# Altium project iRat_2.0.PrjPcb
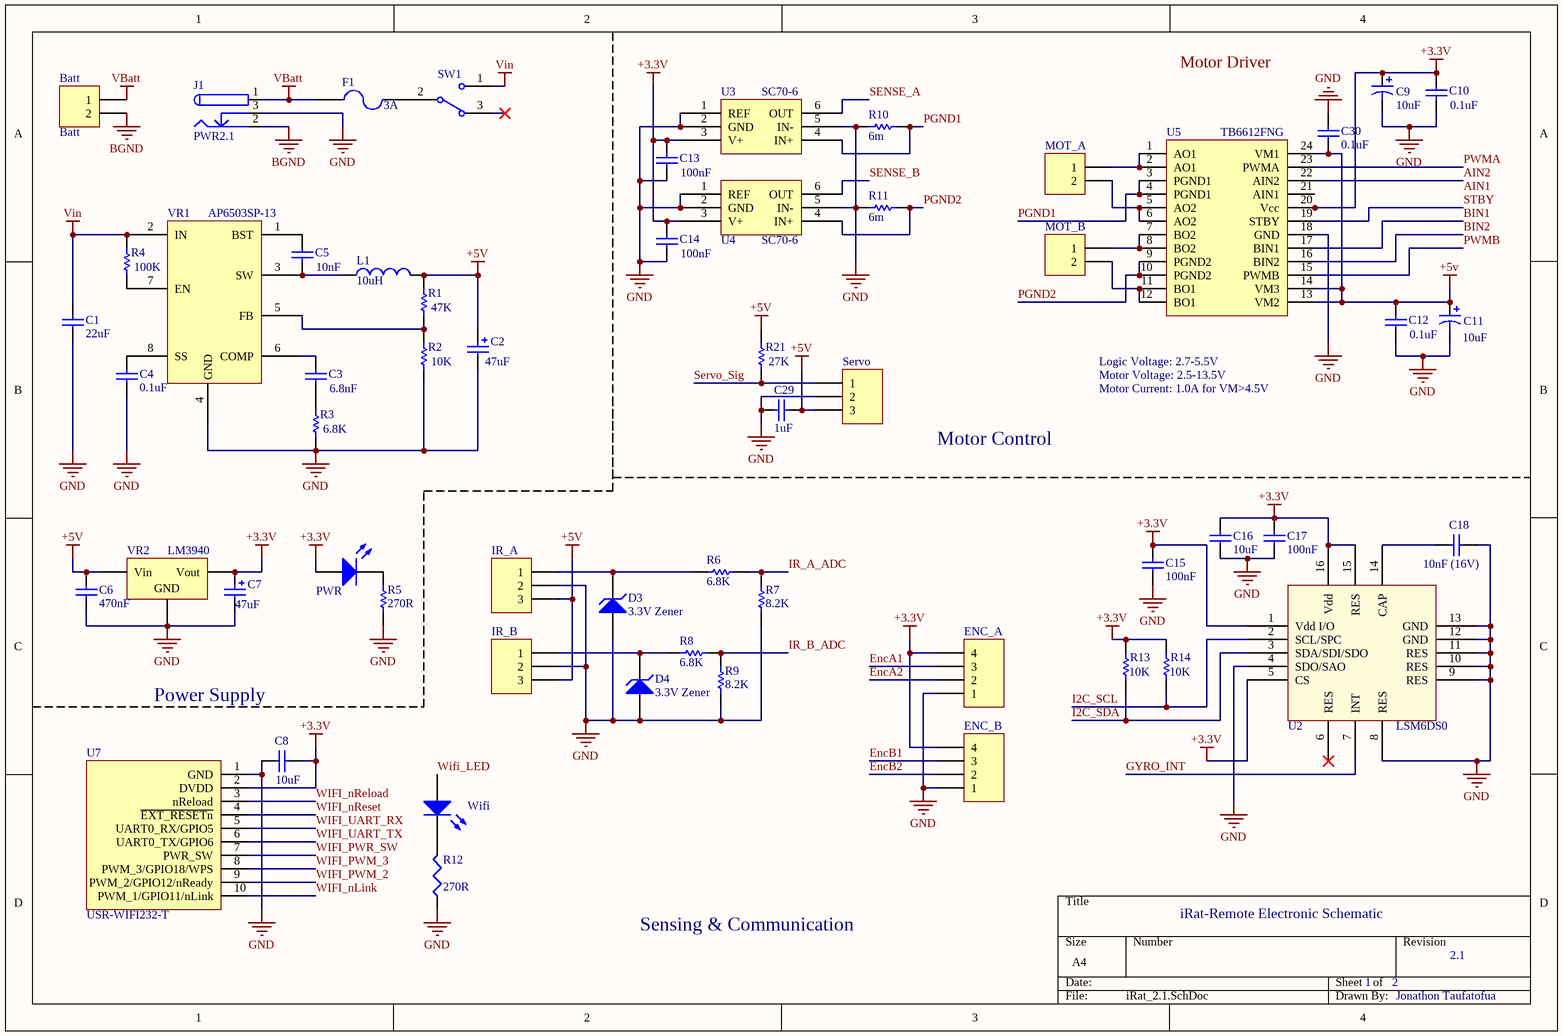
[diagram p0: iRat_2.1.SchDoc]
2 sheets, 82 parts. Net scope: global (net labels, ports and power ports of the same name join across sheets).
Board file: iRat_2.1.PcbDoc
Sheets:
  iRat_2.1.SchDoc
  iRat_2.1_Microcontroller.SchDoc

## Sheet iRat_2.1.SchDoc
size A4

### Parts
Batt  Batt  [Molex 43045-0202]
C1  value 22uF  [0805E]  (hidden comment: Cap Semi)
C2  value 47uF  [Capacitor_SizeD8]  (hidden comment: Cap Pol2)
C3  value 6.8nF  [1608[0603]]  (hidden comment: Cap Semi)
C4  value 0.1uF  [1608[0603]]  (hidden comment: Cap Semi)
C5  value 10nF  [1608[0603]]  (hidden comment: Cap Semi)
C6  value 470nF  [1608[0603]]  (hidden comment: Cap Semi)
C7  value 47uF  [Capacitor_SizeD8]  (hidden comment: Cap Pol2)
C8  value 10uF  [6-0805_N]  (hidden comment: Cap Semi)
C9  value 10uF  [C0805]  (hidden comment: Cap Pol3)
C10  value 0.1uF  [1608[0603]]  (hidden comment: Cap Semi)
C11  value 10uF  [C0805]  (hidden comment: Cap Pol3)
C12  value 0.1uF  [1608[0603]]  (hidden comment: Cap Semi)
C13  value 100nF  [1608[0603]]  (hidden comment: Cap Semi)
C14  value 100nF  [1608[0603]]  (hidden comment: Cap Semi)
C15  value 100nF  [1608[0603]]  (hidden comment: Cap Semi)
C16  value 10uF  [0805E]  (hidden comment: Cap Semi)
C17  value 100nF  [1608[0603]]  (hidden comment: Cap Semi)
C18  value 10nF (16V)  [1608[0603]]  (hidden comment: Req 10nF 10%, 16V Ceramic)
C29  value 1uF  [1608[0603]]  (hidden comment: Cap Semi)
C30  value 0.1uF  [1608[0603]]  (hidden comment: Cap Semi)
D3  3.3V Zener  [MM5Z3V3T1G]
D4  3.3V Zener  [MM5Z3V3T1G]
ENC_A  Header 4  [JST PH 4-Way]  (value not drawn)
ENC_B  Header 4  [JST PH 4-Way]  (value not drawn)
F1  3A  [1812]
IR_A  Header 3  [JST PH 3-Way]  (value not drawn)
IR_B  Header 3  [JST PH 3-Way]  (value not drawn)
J1  PWR2.1  [DCP21]
L1  value 10uH  [SRP7028A-100M]  (hidden comment: Inductor)
MOT_A  Header 2  [HDR1X2]  (value not drawn)
MOT_B  Header 2  [HDR1X2]  (value not drawn)
PWR  LNJ347W83RA  [0402-A]  (value not drawn)
R1  value 47K  [J1-0603]  (hidden comment: Res Semi)
R2  value 10K  [J1-0603]  (hidden comment: Res Semi)
R3  value 6.8K  [J1-0603]  (hidden comment: Res Semi)
R4  value 100K  [J1-0603]  (hidden comment: Res Semi)
R5  value 270R  [0402]  (hidden comment: Res1)
R6  value 6.8K  [0603E]  (hidden comment: Res1)
R7  value 8.2K  [0603E]  (hidden comment: Res1)
R8  value 6.8K  [0603E]  (hidden comment: Res1)
R9  value 8.2K  [0603E]  (hidden comment: Res1)
R10  value 6m  [ERJM1WS]  (hidden comment: Shunt Resistor)
R11  value 6m  [ERJM1WS]  (hidden comment: Shunt Resistor)
R12  value 270R  [0402]  (hidden comment: Res3)
R13  value 10K  [0402]  (hidden comment: Res Semi)
R14  value 10K  [0402]  (hidden comment: Res Semi)
R21  value 27K  [0402]  (hidden comment: Res Semi)
Servo  Servo1  [JST PH 3-Way]  (value not drawn)
SW1  SW-SPDT  [Slide_Switch]  (value not drawn)
U2  LSM6DS0  [LGA16-3X3X1_N]
U3  SC70-6  [SC70]
U4  SC70-6  [SC70]
U5  TB6612FNG  [TSOP65P760X160-24N]
U7  USR-WIFI232-T  [USR-WIFI232-T]
VR1  AP6503SP-13  [SO-8EP]
VR2  LM3940  [SOT223_N]
Wifi  LNJ347W83RA  [0402-A]  (value not drawn)

### Nets
+3.3V: C7.1 C8.1 C9.1 C10.1 C13.2 C14.2 C15.2 C16.2 C17.2 ENC_A.4 ENC_B.4 PWR.1(A) R13.2 R14.2 U2.1(Vdd_I/O) U2.5(CS) U2.15(RES) U2.16(Vdd) U3.3(V+) U4.3(V+) U5.20(Vcc) U7.2(DVDD) VR2.3(Vout)
+5v: C2.1 C6.2 C11.1 C12.1 C29.2 C30.1 IR_A.3 IR_B.3 L1.2 R1.2 R21.2 Servo.3 U5.13(VM2) U5.14(VM3) U5.24(VM1) VR2.1(Vin)
BGND: Batt.2 J1.2
GND: C1.1 C2.2 C4.1 C6.1 C7.2 C8.2 C9.2 C10.2 C11.2 C12.2 C13.1 C14.1 C15.1 C16.1 C17.1 C18.1 C29.1 C30.2 D3.1(A) D4.1(A) ENC_A.1 ENC_B.1 IR_A.2 IR_B.2 J1.3 R2.1 R3.1 R5.1 R7.1 R9.1 R10.2 R11.1 R12.1 Servo.2 U2.4(SDO/SAO) U2.8(RES) U2.9(RES) U2.10(RES) U2.11(RES) U2.12(GND) U2.13(GND) U3.1(REF) U3.2(GND) U3.5(IN-) U4.1(REF) U4.2(GND) U4.5(IN-) U5.18(GND) U7.1(GND) VR1.4(GND) VR2.2(GND)
VBatt: Batt.1 F1.1 J1.1
Vin: C1.2 R4.2 SW1.1 VR1.2(IN)
AIN2: U5.22(AIN2)
BIN1: U5.17(BIN1)
BIN2: U5.16(BIN2)
EncA1: ENC_A.3
EncA2: ENC_A.2
EncB1: ENC_B.3
EncB2: ENC_B.2
GYRO_INT: U2.7(INT)
I2C_SCL: R14.1 U2.2(SCL/SPC)
I2C_SDA: R13.1 U2.3(SDA/SDI/SDO)
IR_A_ADC: R6.1 R7.2
IR_B_ADC: R8.1 R9.2
PGND1: R10.1 U3.4(IN+) U5.3(PGND1) U5.4(PGND1)
PGND2: R11.2 U4.4(IN+) U5.9(PGND2) U5.10(PGND2)
PWMA: U5.23(PWMA)
PWMB: U5.15(PWMB)
SENSE_A: U3.6(OUT)
SENSE_B: U4.6(OUT)
Servo_Sig: R21.1 Servo.1
STBY: U5.19(STBY)
Wifi_LED: Wifi.1(A)
WIFI_nLink: U7.10(PWM_1/GPIO11/nLink)
WIFI_nReload: U7.3(nReload)
WIFI_nReset: U7.4(~{EXT_RESETn})
WIFI_PWM_2: U7.9(PWM_2/GPIO12/nReady)
WIFI_PWM_3: U7.8(PWM_3/GPIO18/WPS)
WIFI_PWR_SW: U7.7(PWR_SW)
WIFI_UART_RX: U7.5(UART0_RX/GPIO5)
WIFI_UART_TX: U7.6(UART0_TX/GPIO6)
NetC3_1: C3.1 R3.2
NetC3_2: C3.2 VR1.6(COMP)
NetC4_2: C4.2 VR1.8(SS)
NetC5_1: C5.1 L1.1 VR1.3(SW)
NetC5_2: C5.2 VR1.1(BST)
NetC18_2: C18.2 U2.14(CAP)
NetD3_2: D3.2(K) IR_A.1 R6.2
NetD4_2: D4.2(K) IR_B.1 R8.2
NetF1_2: F1.2 SW1.2
NetMOT_A_1: MOT_A.1 U5.1(AO1) U5.2(AO1)
NetMOT_A_2: MOT_A.2 U5.5(AO2) U5.6(AO2)
NetMOT_B_1: MOT_B.1 U5.7(BO2) U5.8(BO2)
NetMOT_B_2: MOT_B.2 U5.11(BO1) U5.12(BO1)
NetPWR_2: PWR.2(K) R5.2
NetR1_1: R1.1 R2.2 VR1.5(FB)
NetR4_1: R4.1 VR1.7(EN)
NetR12_2: R12.2 Wifi.2(K)

Not connected (* = marked no-connect by the designer): SW1 3*; U2 6(RES)*; U5 21(AIN1); VR2 4(GND)

### Notes on the sheet
- Motor Driver
- Logic Voltage: 2.7-5.5V
- Motor Voltage: 2.5-13.5V
- Motor Control
- Motor Current: 1.0A for VM>4.5V
- Power Supply
- iRat-Remote Electronic Schematic
- Sensing & Communication
- 1
- 2
- 2.1
- Jonathon Taufatofua
- Labels drawn without touching a wire or pin: AIN1

### Library data of the parts
Batt MOT_A MOT_B = Header 2: Header, 2-Pin; LatestRevisionDate: 17-Jul-2002; LatestRevisionNote: Re-released for DXP Platform.; Publisher: Altium Limited
C1 C3-C6 C8 C10 C12-C18 C29 C30 = Cap Semi: Capacitor (Semiconductor SIM Model); Published: 8-Jun-2000; LatestRevisionDate: 29-May-2009; LatestRevisionNote: IPC-7351 Footprint Added.; PackageReference: C1206; Publisher: Altium Limited; PackageDescription: Chip Capacitor
C2 = Cap Pol2: Polarized Capacitor (Radial); Published: 8-Jun-2000; LatestRevisionDate: 17-Jul-2002; LatestRevisionNote: Re-released for DXP Platform.; PackageReference: POLAR0.8; Publisher: Altium Limited; PackageDescription: Polarized Capacitor; 2 Leads
C7 = Cap Pol2: Polarized Capacitor (Radial); Note: Needs at least 33uF for stability
C9 C11 = Cap Pol3: Polarized Capacitor (Surface Mount); Published: 8-Jun-2000; LatestRevisionDate: 29-May-2009; LatestRevisionNote: IPC-7351 Footprint Added.; PackageReference: C0805; Publisher: Altium Limited; PackageDescription: Chip Capacitor
D3 D4 = D Zener: Zener Diode; Published: 8-Jun-2000; LatestRevisionDate: 17-Jul-2002; LatestRevisionNote: Re-released for DXP Platform.; PackageReference: DIODE-0.7; Publisher: Altium Limited; PackageDescription: Diode, Thru-Hole; 2 Leads; 0.7 in Pin Spacing
ENC_A ENC_B = Header 4: Header, 4-Pin; LatestRevisionDate: 17-Jul-2002; LatestRevisionNote: Re-released for DXP Platform.; Publisher: Altium Limited
F1 = Fuse 2: Fuse; Published: 8-Jun-2000; LatestRevisionDate: 17-Jul-2002; LatestRevisionNote: Re-released for DXP Platform.; PackageReference: PIN-W2/E2.8; Publisher: Altium Limited; PackageDescription: Thru-Hole; 2 Leads
IR_A IR_B Servo = Header 3: Header, 3-Pin; LatestRevisionDate: 17-Jul-2002; LatestRevisionNote: Re-released for DXP Platform.; Publisher: Altium Limited
J1 = PWR2.5: Low Voltage Power Supply Connector; Published: 17-Dec-2003; DatasheetDocument: 09-May-2002; Publisher: Altium Limited; ComponentLink1Description: Manufacturer Link; ComponentLink1URL: http://domino.kycon.com/internet/Products.html
L1 = Inductor: Code_IEC: 1005; Published: 8-Jun-2000; LatestRevisionDate: 29-May-2009; LatestRevisionNote: IPC-7351 Footprint Added.; PackageReference: 0402-A; Publisher: Altium Limited; PackageDescription: Chip Inductor; Code_JEITA: 0402
PWR = LED2: GREEN Power LED; Published: 8-Jun-2000; LatestRevisionDate: 17-Jul-2002; LatestRevisionNote: Re-released for DXP Platform.; PackageVersion: Feb-2002; PackageReference: 3.2X1.6X1.1; Publisher: Altium Limited; PackageDescription: SM LED; 2 Flat Leads
R1-R4 R13 R14 R21 = Res Semi: Semiconductor Resistor; Published: 8-Jun-2000; LatestRevisionDate: 17-Jul-2002; LatestRevisionNote: Re-released for DXP Platform.; PackageReference: AXIAL-0.5; Publisher: Altium Limited; PackageDescription: Axial Device, Thru-Hole; 2 Leads; 0.5 in Pin Spacing
R5-R9 = Res1: Resistor; Published: 8-Jun-2000; LatestRevisionDate: 17-Jul-2002; LatestRevisionNote: Re-released for DXP Platform.; PackageReference: AXIAL-0.3; Publisher: Altium Limited; PackageDescription: Axial Device, Thru-Hole; 2 Leads; 0.3 in Pin Spacing
R10 R11 = Res1: Current Sense Resistor; Published: 8-Jun-2000; LatestRevisionDate: 17-Jul-2002; LatestRevisionNote: Re-released for DXP Platform.; PackageReference: AXIAL-0.3; Publisher: Altium Limited; PackageDescription: Axial Device, Thru-Hole; 2 Leads; 0.3 in Pin Spacing
R12 = Res3: Resistor; Published: 8-Jun-2000; LatestRevisionDate: 29-May-2009; LatestRevisionNote: IPC-7351 Footprint Added.; PackageReference: J1-0603; Publisher: Altium Limited; PackageDescription: Chip Resistor
SW1 = SW-SPDT: SPDT Subminiature Toggle Switch, Right Angle Mounting, Vertical Actuation; Published: 24-Mar-1999; LatestRevisionDate: 17-Dec-2003; LatestRevisionNote: Schematic revised, PCB Footprint replaced.; DatasheetVersion: 05-Dec-2000; PackageReference: TL36WW15050; Publisher: Altium Limited; PackageDescription: Switch; 4 Leads; ComponentLink1Description: Manufacturer Link; ComponentLink1URL: http://www.apem.com
U2 = LSM6DS0: gyroscope and accelerometer
U5 = TB6612FNG IC: Motor Driver IC
VR1 = AP6503SP-13: Adjustable Switching Regulator
VR2 = Volt Reg: Voltage Regulator; Published: 24-Mar-1999; LatestRevisionDate: 29-May-2009; LatestRevisionNote: IPC-7351 Footprint Added.; PackageReference: D2PAK; Publisher: Altium Limited; PackageDescription: 3-Pin Transistor Outline Package 2.54 mm Pitch, 15.1 mm Lead Span
Wifi = LED2: GREEN Wifi LED; Published: 8-Jun-2000; LatestRevisionDate: 17-Jul-2002; LatestRevisionNote: Re-released for DXP Platform.; PackageVersion: Feb-2002; PackageReference: 3.2X1.6X1.1; Publisher: Altium Limited; PackageDescription: SM LED; 2 Flat Leads

## Sheet iRat_2.1_Microcontroller.SchDoc
size A4
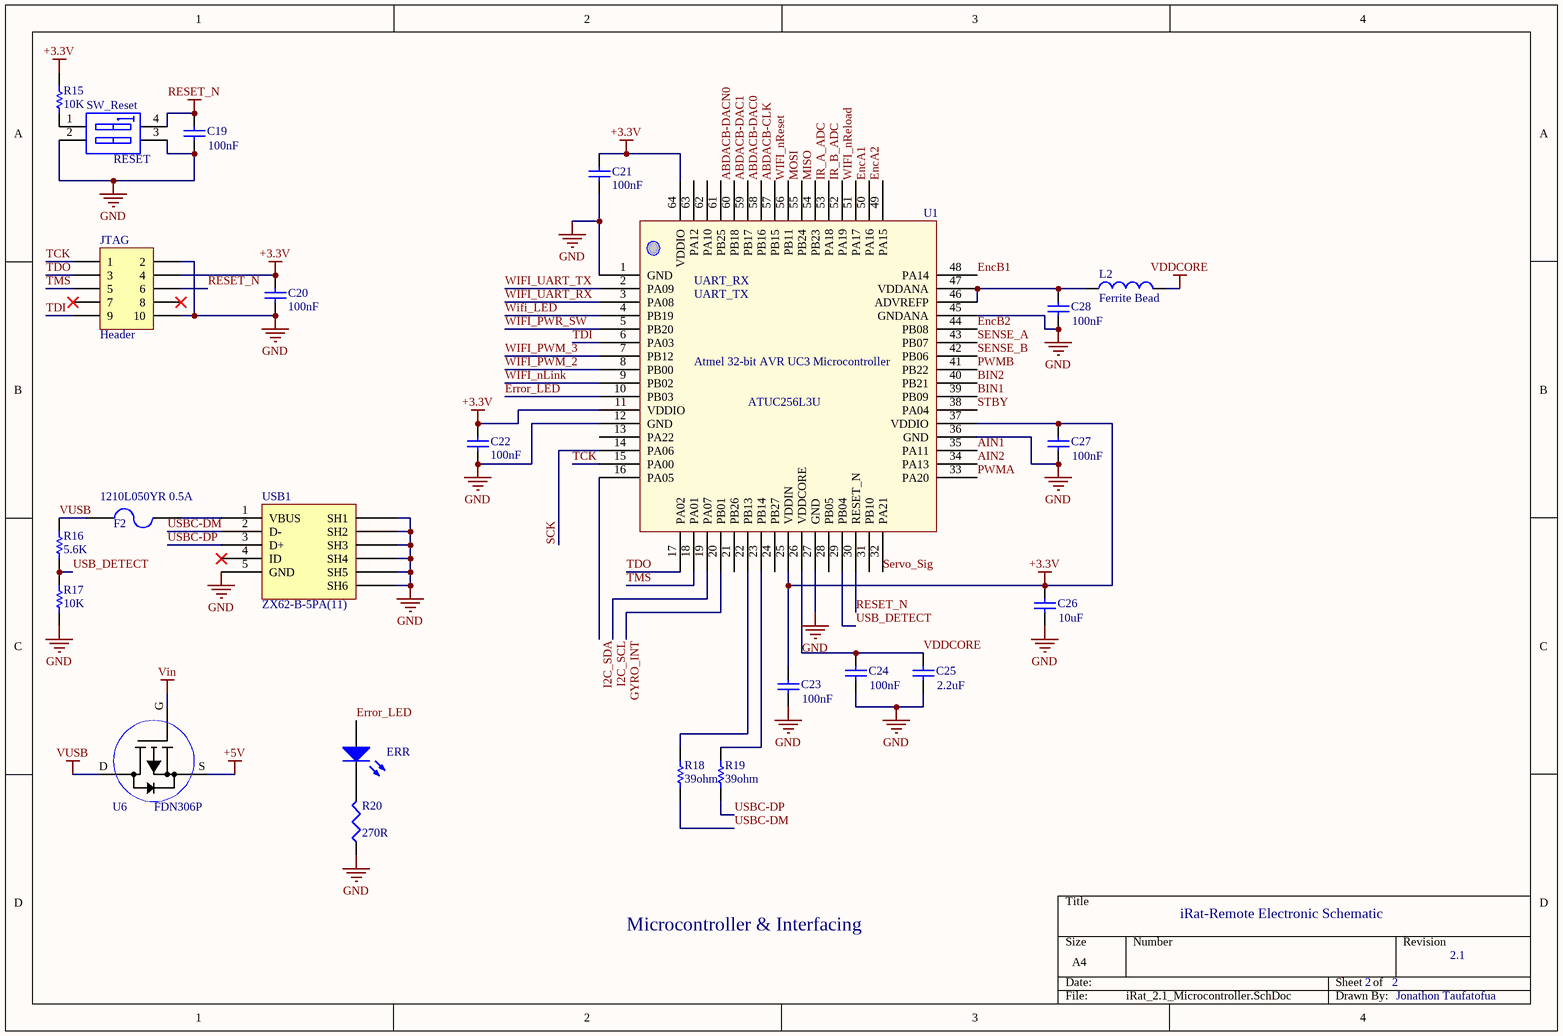
[diagram p1: iRat_2.1_Microcontroller.SchDoc]

### Parts
C19  value 100nF  [1608[0603]]  (hidden comment: Cap Semi)
C20  value 100nF  [1608[0603]]  (hidden comment: Cap Semi)
C21  value 100nF  [1608[0603]]  (hidden comment: Cap Semi)
C22  value 100nF  [1608[0603]]  (hidden comment: Cap Semi)
C23  value 100nF  [1608[0603]]  (hidden comment: Cap Semi)
C24  value 100nF  [1608[0603]]  (hidden comment: Cap Semi)
C25  value 2.2uF  [C1206]  (hidden comment: Cap Semi)
C26  value 10uF  [C1206]
C27  value 100nF  [1608[0603]]  (hidden comment: Cap Semi)
C28  value 100nF  [1608[0603]]  (hidden comment: Cap Semi)
ERR  LNJ347W83RA  [0402-A]  (value not drawn)
F2  1210L050YR 0.5A  [14-1210]
JTAG  Header  [HDR2X5]
L2  Ferrite Bead  [0805E]
R15  value 10K  [0402]
R16  value 5.6K  [0402]  (hidden comment: Res Semi)
R17  value 10K  [0402]  (hidden comment: Res Semi)
R18  value 39ohm  [0603E]  (hidden comment: Res1)
R19  value 39ohm  [0603E]  (hidden comment: Res1)
R20  value 270R  [0402]  (hidden comment: Res3)
SW_Reset  RESET  [SW16]
U1  ATUC256L3U-AUT  [TQFP64_M]  (value not drawn)
U6  FDN306P  [FDN306P]
USB1  ZX62-B-5PA(11)  [ZX62-B-5PA(11)]

### Nets
+3.3V: C20.1 C21.2 C22.2 C23.2 C26.2 C27.2 JTAG.4 R15.1 U1.11(VDDIO) U1.25(VDDIN) U1.37(VDDIO) U1.64(VDDIO)
+5v: U6.S
GND: C19.1 C20.2 C21.1 C22.1 C23.1 C24.1 C25.1 C26.1 C27.1 C28.1 JTAG.2 JTAG.10 R17.1 R20.1 SW_Reset.2 SW_Reset.3 U1.1(GND) U1.12(GND) U1.27(GND) U1.36(GND) U1.45(GNDANA) USB1.5(GND) USB1.SH1 USB1.SH2 USB1.SH3 USB1.SH4 USB1.SH5 USB1.SH6
RESET_N: C19.2 JTAG.6 SW_Reset.4 U1.30(RESET_N)
VDDCORE: C24.2 C25.2 L2.2 U1.26(VDDCORE)
Vin: U6.G
VUSB: F2.2 R16.2 U6.D
ABDACB-CLK: U1.57(PB15)
ABDACB-DAC0: U1.58(PB16)
ABDACB-DAC1: U1.59(PB17)
ABDACB-DACN0: U1.60(PB18)
AIN1: U1.35(PA11)
AIN2: U1.34(PA13)
BIN1: U1.39(PB09)
BIN2: U1.40(PB21)
EncA1: U1.50(PA16)
EncA2: U1.49(PA15)
EncB1: U1.48(PA14)
EncB2: U1.44(PB08)
Error_LED: ERR.1(A) U1.10(PB03)
GYRO_INT: U1.20(PB01)
I2C_SCL: U1.19(PA07)
I2C_SDA: U1.16(PA05)
IR_A_ADC: U1.53(PA18)
IR_B_ADC: U1.52(PA19)
MISO: U1.54(PB23)
MOSI: U1.55(PB24)
PWMA: U1.33(PA20)
PWMB: U1.41(PB22)
SCK: U1.14(PA06)
SENSE_A: U1.43(PB07)
SENSE_B: U1.42(PB06)
Servo_Sig: U1.32(PA21)
STBY: U1.38(PA04)
TCK: JTAG.1 U1.15(PA00)
TDI: JTAG.9 U1.6(PA03)
TDO: JTAG.3 U1.17(PA02)
TMS: JTAG.5 U1.18(PA01)
USB_DETECT: R16.1 R17.2 U1.29(PB04)
USBC-DM: R18.2 USB1.2(D-)
USBC-DP: R19.2 USB1.3(D+)
Wifi_LED: U1.4(PB19)
WIFI_nLink: U1.9(PB02)
WIFI_nReload: U1.51(PA17)
WIFI_nReset: U1.56(PB11)
WIFI_PWM_2: U1.8(PB00)
WIFI_PWM_3: U1.7(PB12)
WIFI_PWR_SW: U1.5(PB20)
WIFI_UART_RX: U1.3(PA08)
WIFI_UART_TX: U1.2(PA09)
NetC28_2: C28.2 L2.1 U1.46(ADVREFP) U1.47(VDDANA)
NetERR_2: ERR.2(K) R20.2
NetF2_1: F2.1 USB1.1(VBUS)
NetR15_2: R15.2 SW_Reset.1
NetR18_1: R18.1 U1.22(PB13)
NetR19_1: R19.1 U1.23(PB14)

Not connected (* = marked no-connect by the designer): JTAG 7* 8*; U1 13(PA22) 21(PB26) 24(PB27) 28(PB05) 31(PB10) 61(PB25) 62(PA10) 63(PA12); USB1 4(ID)*

### Notes on the sheet
- (near U1) UART_TX
- (near U1) UART_RX
- iRat-Remote Electronic Schematic
- Microcontroller & Interfacing
- 2
- 2.1
- Jonathon Taufatofua
- (in symbol ATUC256L3U-AUT) ATUC256L3U

### Library data of the parts
C19-C28 = Cap Semi: Capacitor (Semiconductor SIM Model); Published: 8-Jun-2000; LatestRevisionDate: 29-May-2009; LatestRevisionNote: IPC-7351 Footprint Added.; PackageReference: C1206; Publisher: Altium Limited; PackageDescription: Chip Capacitor
ERR = LED2: GREEN Wifi LED; Published: 8-Jun-2000; LatestRevisionDate: 17-Jul-2002; LatestRevisionNote: Re-released for DXP Platform.; PackageVersion: Feb-2002; PackageReference: 3.2X1.6X1.1; Publisher: Altium Limited; PackageDescription: SM LED; 2 Flat Leads
F2 = Fuse 2: Fuse; Published: 8-Jun-2000; LatestRevisionDate: 17-Jul-2002; LatestRevisionNote: Re-released for DXP Platform.; PackageReference: PIN-W2/E2.8; Publisher: Altium Limited; PackageDescription: Thru-Hole; 2 Leads
JTAG = Header 5X2: Header, 5-Pin, Dual row; LatestRevisionDate: 17-Jul-2002; LatestRevisionNote: Re-released for DXP Platform.; Publisher: Altium Limited
L2 = Inductor: MLS0805-4S7-301; Code_IEC: 1005; Published: 8-Jun-2000; LatestRevisionDate: 29-May-2009; LatestRevisionNote: IPC-7351 Footprint Added.; PackageReference: 0402-A; Publisher: Altium Limited; PackageDescription: Chip Inductor; Code_JEITA: 0402
R15-R17 = Res Semi: Semiconductor Resistor; Published: 8-Jun-2000; LatestRevisionDate: 17-Jul-2002; LatestRevisionNote: Re-released for DXP Platform.; PackageReference: AXIAL-0.5; Publisher: Altium Limited; PackageDescription: Axial Device, Thru-Hole; 2 Leads; 0.5 in Pin Spacing
R18 R19 = Res1: Resistor; Published: 8-Jun-2000; LatestRevisionDate: 17-Jul-2002; LatestRevisionNote: Re-released for DXP Platform.; PackageReference: AXIAL-0.3; Publisher: Altium Limited; PackageDescription: Axial Device, Thru-Hole; 2 Leads; 0.3 in Pin Spacing
R20 = Res3: Resistor; Published: 8-Jun-2000; LatestRevisionDate: 29-May-2009; LatestRevisionNote: IPC-7351 Footprint Added.; PackageReference: J1-0603; Publisher: Altium Limited; PackageDescription: Chip Resistor
SW_Reset = SW DIP-2: DIP Switch, 2 Position, SPST; pin to pad: 3>2 4>1; Published: 24-Mar-1999; LatestRevisionDate: 17-Jul-2002; LatestRevisionNote: Re-released for DXP Platform.; PackageReference: DIP-4; Publisher: Altium Limited
U1 = ATUC256L3U-AUT: Atmel 32-bit AVR UC3 Microcontroller
USB1 = ZX62-B-5PA(11): Micro-B USB Receptacle

## Nets that join several sheets
+3.3V: iRat_2.1 (23 pins), iRat_2.1_Microcontroller (12 pins)
+5v: iRat_2.1 (16 pins), iRat_2.1_Microcontroller (U6.S)
GND: iRat_2.1 (51 pins), iRat_2.1_Microcontroller (28 pins)
Vin: iRat_2.1 (C1.2 R4.2 SW1.1 VR1.2), iRat_2.1_Microcontroller (U6.G)
AIN2: iRat_2.1 (U5.22), iRat_2.1_Microcontroller (U1.34)
BIN1: iRat_2.1 (U5.17), iRat_2.1_Microcontroller (U1.39)
BIN2: iRat_2.1 (U5.16), iRat_2.1_Microcontroller (U1.40)
EncA1: iRat_2.1 (ENC_A.3), iRat_2.1_Microcontroller (U1.50)
EncA2: iRat_2.1 (ENC_A.2), iRat_2.1_Microcontroller (U1.49)
EncB1: iRat_2.1 (ENC_B.3), iRat_2.1_Microcontroller (U1.48)
EncB2: iRat_2.1 (ENC_B.2), iRat_2.1_Microcontroller (U1.44)
GYRO_INT: iRat_2.1 (U2.7), iRat_2.1_Microcontroller (U1.20)
I2C_SCL: iRat_2.1 (R14.1 U2.2), iRat_2.1_Microcontroller (U1.19)
I2C_SDA: iRat_2.1 (R13.1 U2.3), iRat_2.1_Microcontroller (U1.16)
IR_A_ADC: iRat_2.1 (R6.1 R7.2), iRat_2.1_Microcontroller (U1.53)
IR_B_ADC: iRat_2.1 (R8.1 R9.2), iRat_2.1_Microcontroller (U1.52)
PWMA: iRat_2.1 (U5.23), iRat_2.1_Microcontroller (U1.33)
PWMB: iRat_2.1 (U5.15), iRat_2.1_Microcontroller (U1.41)
SENSE_A: iRat_2.1 (U3.6), iRat_2.1_Microcontroller (U1.43)
SENSE_B: iRat_2.1 (U4.6), iRat_2.1_Microcontroller (U1.42)
Servo_Sig: iRat_2.1 (R21.1 Servo.1), iRat_2.1_Microcontroller (U1.32)
STBY: iRat_2.1 (U5.19), iRat_2.1_Microcontroller (U1.38)
Wifi_LED: iRat_2.1 (Wifi.1), iRat_2.1_Microcontroller (U1.4)
WIFI_nLink: iRat_2.1 (U7.10), iRat_2.1_Microcontroller (U1.9)
WIFI_nReload: iRat_2.1 (U7.3), iRat_2.1_Microcontroller (U1.51)
WIFI_nReset: iRat_2.1 (U7.4), iRat_2.1_Microcontroller (U1.56)
WIFI_PWM_2: iRat_2.1 (U7.9), iRat_2.1_Microcontroller (U1.8)
WIFI_PWM_3: iRat_2.1 (U7.8), iRat_2.1_Microcontroller (U1.7)
WIFI_PWR_SW: iRat_2.1 (U7.7), iRat_2.1_Microcontroller (U1.5)
WIFI_UART_RX: iRat_2.1 (U7.5), iRat_2.1_Microcontroller (U1.3)
WIFI_UART_TX: iRat_2.1 (U7.6), iRat_2.1_Microcontroller (U1.2)